# EAGLE design Aurel-super-regen-receiver-ASR2 (EAGLE 7.2.0)
https://sites.google.com/site/aurelwwiz/aurelso
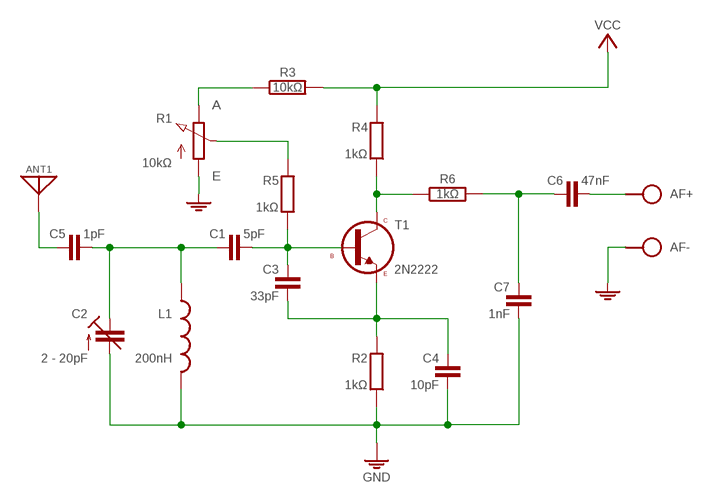
[diagram p0: schematic, sheet 1]

## Parts
AF  SPAD+-+-  [SPAD+-]
ANT1  ANT  [SPAD]
C1  5pF  C-H025-015X024  [C025-015X024]
C2  2 - 20pF  C-TR-PH201272222-808-2PINB  [TRIM-2222-808]
C3  33pF  C025-015X024  [C025-015X024]
C4  10pF  C025-015X024  [C025-015X024]
C5  1pF  C-H025-015X024  [C025-015X024]
C6  47nF  C-H050-020X044  [C050-020X044]
C7  1nF  C050-020X044/V  [C050-020X044/V]
L1  200nH  L04/7-V  [L-04/7-V]
R1  10kΩ  POT  [POT]
R2  1kΩ  R0204/10-V  [0204/10-V]
R3  10kΩ  R-H0204/10  [0204/10]
R4  1kΩ  R0204/10-V  [0204/10-V]
R5  1kΩ  R0204/10-V  [0204/10-V]
R6  1kΩ  R-H0204/10  [0204/10]
S2  VCC_GNDPWR-L  [PWR-L]
T1  2N2222  [TO92-EBC]

## Nets
GND: AF.1 C2.2(A) C4.2 C7.2 L1.2 R1.A R2.2 S2.1
N$1: ANT1.1 C5.1
N$2: C1.1 C2.3(E) C5.2 L1.1
N$3: C1.2 C3.1 R5.2 T1.B
N$5: C3.2 C4.1 R2.1 T1.E
N$6: R4.2 R6.1 T1.C
N$7: R1.S R5.1
N$8: R1.E R3.1
N$10: C6.1 C7.1 R6.2
N$11: AF.2 C6.2
VCC: R3.2 R4.1 S2.2

## Library data of the parts
AF = pad:SPAD+-
ANT1 = pad:ANT
C1 C5 C6 = c:C-H
C2 = cap-trim:C-TR-PH20127
C3 C4 C7 = c:C: CAPACITOR, European symbol
L1 = l:L: Potentiometers Beckman, Copal, Piher, Spectrol, Schukat Created by librarian@cadsoft.de
R1 = r:POT
R2 R4 R5 = r:R: RESISTOR, European symbol
R3 R6 = r:R-H
S2 = pad:VCC_GND
T1 = t:2N2222

## Board
https://sites.google.com/site/aurelwwiz/aurelso
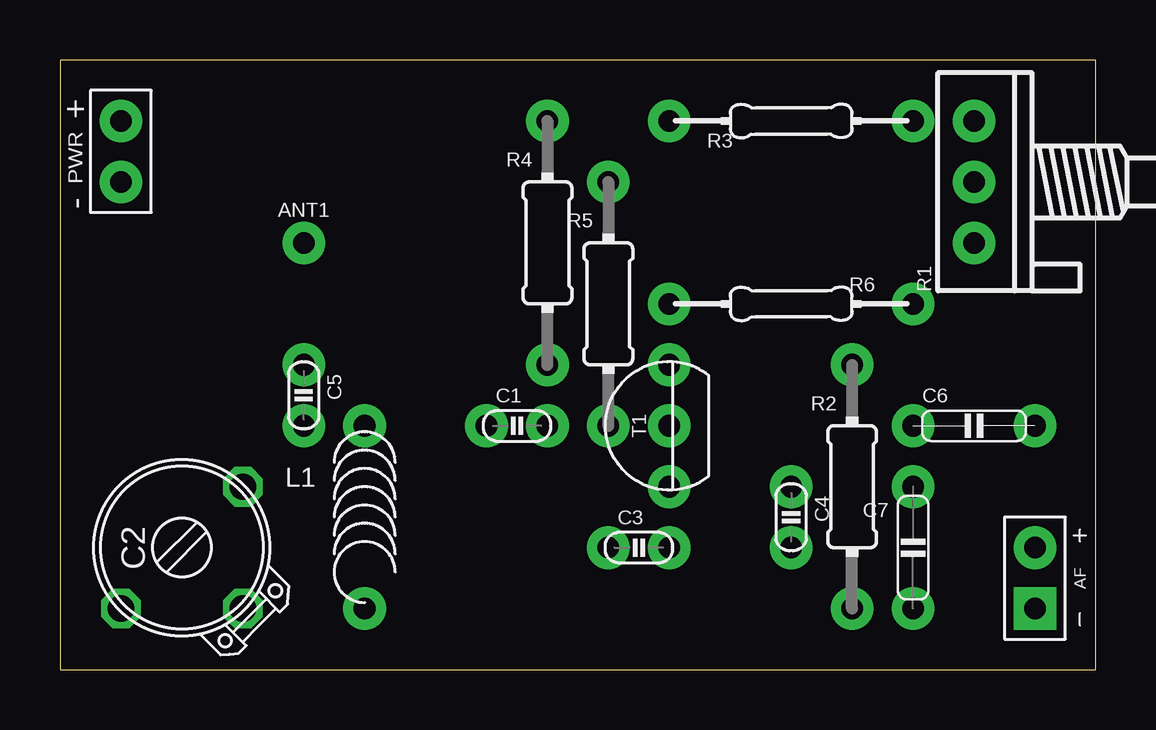
[diagram p1: board, top side]
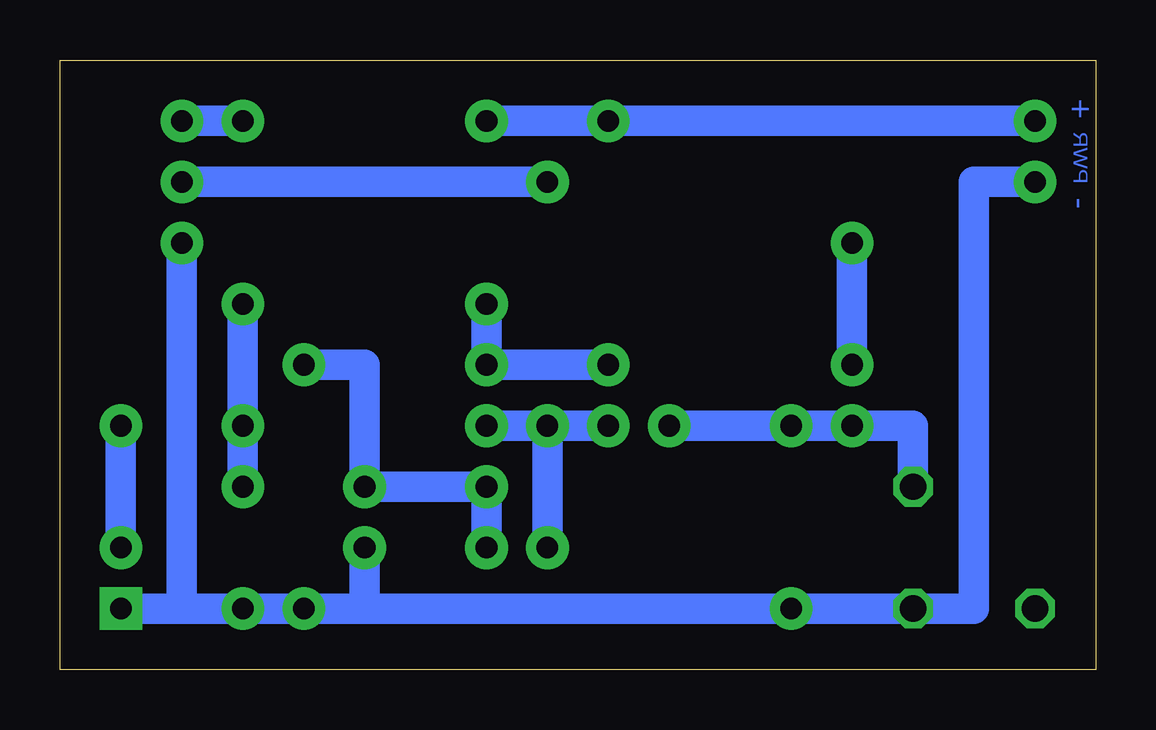
[diagram p2: board, bottom side, seen from below]

Size 43.18 x 25.4 mm. Coordinates in mm from the lower left corner, seen from the top.
Outline: 0,0 43.18,0 43.18,25.4 0,25.4 0,0
Copper layers (1*16): Top 0.035mm / dielectric 1.5mm / Bottom 0.035mm
Design rules "default": minimum track width 10mil, minimum drill 24mil, track to track 8mil, track to pad 8mil, pad to pad 8mil, via to via 8mil, smd to smd 8mil, copper to edge 40mil, drill to drill 8mil, minimum pad ring 10mil, minimum via ring 8mil, stop-mask expansion 4mil, vias tented up to drill 0mil, thermal gap 10mil

### Footprints (pad centres in the part's own frame; a part is rotated, then mirrored left to right if it is on the bottom)
SPAD+- = drill 0.9 pad 1.778 square: 1 0,-1.27 | drill 0.9 pad 1.778: 2 0,1.27
SPAD = drill 0.9 pad 1.778: 1 0,0
C025-015X024 = drill 0.9 pad 1.778: 1 -1.27,0; 2 1.27,0
TRIM-2222-808 = drill 1.1 octagon: 1 -2.54,2.54; 2 -2.54,-2.54; 3 2.54,-2.54
C050-020X044 = drill 0.9 pad 1.778: 1 -2.54,0; 2 2.54,0
C050-020X044/V = drill 0.9 pad 1.778: 1 0,2.54; 2 0,-2.54
L-04/7-V = drill 0.9 pad 1.778: 1 0,3.81; 2 0,-3.81
POT = drill 0.9 pad 1.778: A -2.54,0; E 2.54,0; S 0,0
0204/10-V = drill 0.9 pad 1.778: 1 0,5.08; 2 0,-5.08
0204/10 = drill 0.9 pad 1.778: 1 -5.08,0; 2 5.08,0
PWR-L = drill 0.9 pad 1.778: 1 0,1.27; 2 0,-1.27
TO92-EBC = drill 0.9 pad 1.778: B 0,0; C 0,-2.54; E 0,2.54

### Placement (x,y rotation side)
AF  40.64,3.81 0 top
ANT1  10.16,17.78 270 top
C1  19.05,10.16 0 top
C2  5.08,5.08 90 top
C3  24.13,5.08 0 top
C4  30.48,6.35 270 top
C5  10.16,11.43 270 top
C6  38.1,10.16 0 top
C7  35.56,5.08 0 top
L1  12.7,6.35 0 top
R1  10kΩ  [POT]  38.1,20.32 90 top
R2  1kΩ  [0204/10-V]  33.02,7.62 0 top
R3  10kΩ  [0204/10]  30.48,22.86 180 top
R4  1kΩ  [0204/10-V]  20.32,17.78 0 top
R5  1kΩ  [0204/10-V]  22.86,15.24 0 top
R6  1kΩ  [0204/10]  30.48,15.24 0 top
S2  2.54,21.59 180 top
T1  25.4,10.16 180 top

### Tracks (layer width: path | path; a pad name or v marks a point on that pad's centre or on a via)
GND
  Bottom 1.27: 38.1,2.54 C7.2 R2.2 30.48,2.54 | 38.1,2.54 AF.1 | 30.48,2.54 L1.2 C2.2 5.08,2.54 5.08,20.32 S2.1 | 30.48,2.54 C4.2 | R1.A 38.1,2.54
N$1
  Bottom 1.27: C5.1 ANT1.1
N$2
  Bottom 1.27: C2.3 7.62,10.16 C5.2 L1.1 C1.1
N$3
  Bottom 1.27: R5.2 C3.1 | R5.2 C1.2 | R5.2 T1.B
N$5
  Bottom 1.27: C3.2 T1.E C4.1 30.48,12.7 R2.1
N$6
  Bottom 1.27: R4.2 T1.C R6.1
N$7
  Bottom 1.27: R5.1 R1.S
N$8
  Bottom 1.27: R3.1 R1.E
N$10
  Bottom 1.27: R6.2 C7.1 C6.1
N$11
  Bottom 1.27: C6.2 AF.2
VCC
  Bottom 1.27: R3.2 R4.1 S2.2